# Altium project Lumos_v.0.2.PrjPCB
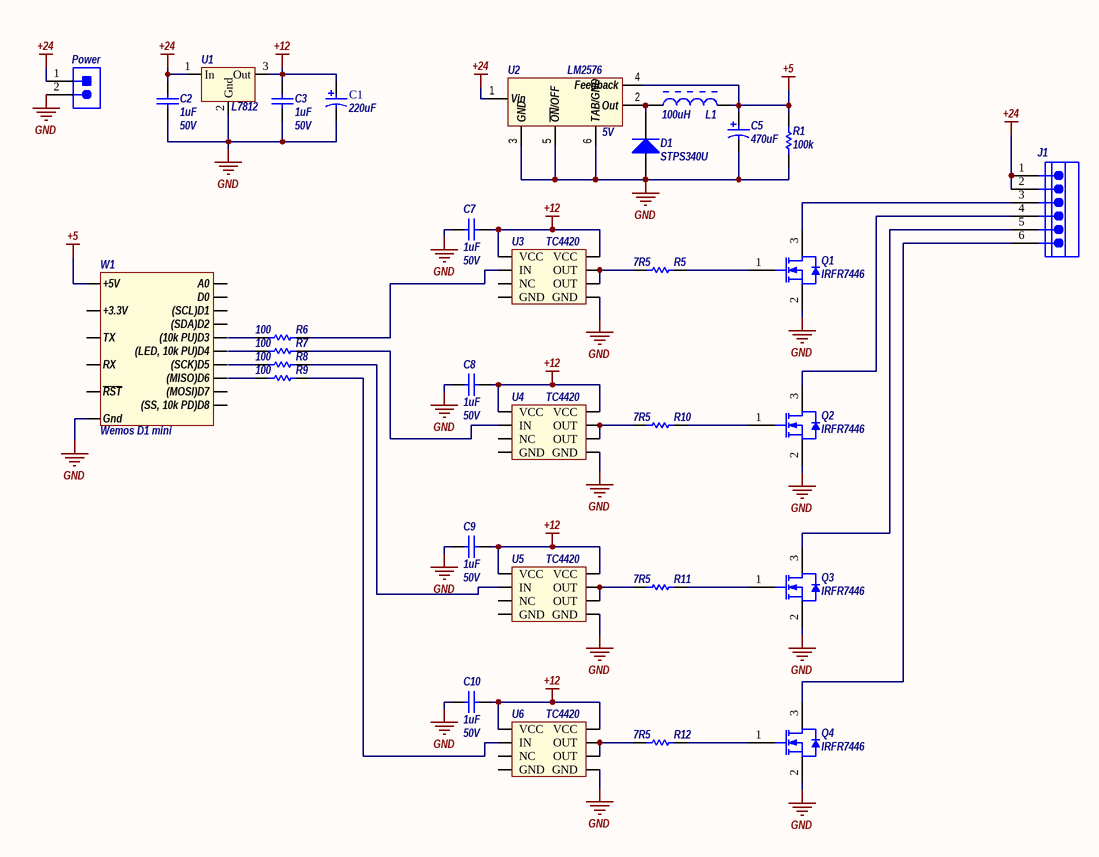
[diagram p0: Lumos_v.0.2.SchDoc]
1 sheet, 32 parts. Net scope: global (net labels, ports and power ports of the same name join across sheets).
Board file: Lumos_v.0.2_prom.PcbDoc

## Sheet Lumos_v.0.2.SchDoc
size A4

### Parts
C1  220uF  [ECAP_Radial_8x11]
C2  1uF  Voltage: 50V  [CAPC0805]
C3  1uF  Voltage: 50V  [CAPC0805]
C5  470uF  [ECAP_Radial_8x11]
C7  1uF  Voltage: 50V  [CAPC0805]
C8  1uF  Voltage: 50V  [CAPC0805]
C9  1uF  Voltage: 50V  [CAPC0805]
C10  1uF  Voltage: 50V  [CAPC0805]
D1  STPS340U  [SMB]
J1  KMRJ103-5.0/508 6WAYS  [KONV-KMRJ103-5-508-6_V]  (value not drawn)
L1  100uH  [RLB1314-101KL]
Power  SCREW-5.0/5.08 2WAYS  [SCREW-5.0-2WAYS_V]  (value not drawn)
Q1  IRFR7446  [D-PAK]
Q2  IRFR7446  [D-PAK]
Q3  IRFR7446  [D-PAK]
Q4  IRFR7446  [D-PAK]
R1  100k  [RES1206]
R5  7R5  [RES1206]
R6  100  [RES0603]
R7  100  [RES0603]
R8  100  [RES0603]
R9  100  [RES0603]
R10  7R5  [RES1206]
R11  7R5  [RES1206]
R12  7R5  [RES1206]
U1  L7812  [D2PAK-2]
U2  5V  [TO-263-5]
U3  TC4420  [SO-8]
U4  TC4420  [SO-8]
U5  TC4420  [SO-8]
U6  TC4420  [SO-8]
W1  Wemos D1 mini  [Wemos D1 mini]

### Nets
+5: C5.1 L1.2 R1.2 U2.4(Feedback) W1.+5V
+12: C1.1 C3.2 C7.2 C8.2 C9.2 C10.2 U1.3(Out) U3.1(VCC) U3.8(VCC) U4.1(VCC) U4.8(VCC) U5.1(VCC) U5.8(VCC) U6.1(VCC) U6.8(VCC)
+24: C2.2 J1.1 J1.2 Power.1 U1.1(In) U2.1(Vin)
GND: C1.2 C2.1 C3.1 C5.2 C7.1 C8.1 C9.1 C10.1 D1.1(A) Power.2 Q1.2(S) Q2.2(S) Q3.2(S) Q4.2(S) R1.1 U1.2(Gnd) U2.3(GND) U2.5(~{ON}/OFF) U2.6(TAB/GND) U3.5(GND) U4.5(GND) U5.5(GND) U6.5(GND) W1.Gnd
NetD1_2: D1.2(K) L1.1 U2.2(Out)
NetJ1_3: J1.3 Q1.3(D)
NetJ1_4: J1.4 Q2.3(D)
NetJ1_5: J1.5 Q3.3(D)
NetJ1_6: J1.6 Q4.3(D)
NetQ1_1: Q1.1(G) R5.2
NetQ2_1: Q2.1(G) R10.2
NetQ3_1: Q3.1(G) R11.2
NetQ4_1: Q4.1(G) R12.2
NetR5_1: R5.1 U3.6(OUT) U3.7(OUT)
NetR6_2: R6.2 U3.2(IN)
NetR7_2: R7.2 U4.2(IN)
NetR8_2: R8.2 U5.2(IN)
NetR9_2: R9.2 U6.2(IN)
NetR10_1: R10.1 U4.6(OUT) U4.7(OUT)
NetR11_1: R11.1 U5.6(OUT) U5.7(OUT)
NetR12_1: R12.1 U6.6(OUT) U6.7(OUT)

Not connected (* = marked no-connect by the designer): R6 1; R7 1; R8 1; R9 1; U3 3(NC) 4(GND); U4 3(NC) 4(GND); U5 3(NC) 4(GND); U6 3(NC) 4(GND); W1 +3.3V A0 D0 D1((SCL)D1) D2((SDA)D2) D3((10k_PU)D3) D4((LED,_10k_PU)D4) D5((SCK)D5) D6((MISO)D6) D7((MOSI)D7) D8((SS,_10k_PD)D8) RST(~{RST}) RX TX

### Library data of the parts
C1 = ECAP_Radial_8x11: Voltage: 25V; Capacitance: 220uF
C2 C3 C7-C10 = CAP_SMD_ceramic: Value: 1uF
C5 = ECAP_Radial_8x11: Capacitance: 470uF; Voltage: *
D1 = Diode: Model: STPS340U
J1 = CMP-0407-00002-1: Socket, Screw Terminal Block, 6 Way, 5.0mm Pitch, 45 Degree Angle, Through-hole; Manufacturer: Konvee Electronic; PackageReference: KMRJ103-5-508-6; PartNumber: KMRJ103-5.0/508 6WAYS; PackageDescription: Socket, 6-way, 5.0mm Pitch Terminal Block; ComponentLink1Description: Manufacturer URL; Mounting Technology: Through Hole; ComponentLink1URL: http://www.konvee.com/
L1 = Inductor: Value: 100uH
Power = CMP-0617-00009-1: Socket, Screw Terminal Block, 2 Way, 5.0 mm Pitch, 90 Degree Angle, Through-Hole; Manufacturer: No Vendor; Insulation Resistance: 5000 MOhm / 1000 V; Contact Resistance: 20 mOhm; Rated Current: 25 A; Poles: 2; Rated Voltage: 300 V; PartNumber: SCREW-5.0/5.08 2WAYS; ComponentLink1Description: Datasheet; ComponentLink1URL: 5mm screw terminal in SVN; Mounting Technology: Through Hole; PackageDescription: Socket, Screw Terminal Block, 2 Way, Pitch 5 mm, 90 Degree Angle, Through-Hole; Temperature Range: -40 to 105 degC
Q1-Q4 = MOSFET-N: pin to pad: 2>3 3>4; Voltage: *; Current: *; Power dissipation: *; Model: IRFR7446
R1 R5-R12 = RES_SMD
  R1: Value: 100k
  R5 R10-R12: Value: 7R5
  R6-R9: Value: 100
U1 = L78xx: pin to pad: 2>4; Output voltage: *; Current: *; Power: *; Model: L7812
U2 = LM2576: Current: *; Voltage: 5V; Model: LM2576